# Altium schematic sheet level_shifter.SchDoc
size A4
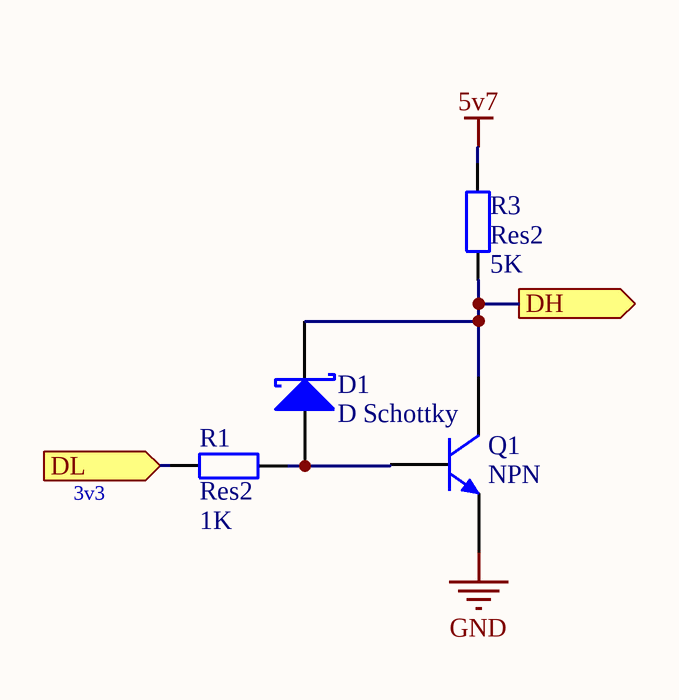
[diagram p0: level_shifter.SchDoc]

## Parts
D1  D Schottky  [SMB]
Q1  NPN  [TO-226-AA]
R1  Res2  value 1K  [AXIAL-0.4]
R3  Res2  value 5K  [AXIAL-0.4]

## Ports
DH (out), DL (in)

## Nets
5v7: R3.2
GND: Q1.3(E)
DH: D1.2(K) Q1.1(C) R3.1 ; port DH
DL: R1.1 ; port DL
NetD1_1: D1.1(A) Q1.2(B) R1.2

## Library data of the parts
D1 = D Schottky: Schottky Diode; Published: 8-Jun-2000; LatestRevisionDate: 17-Jul-2002; LatestRevisionNote: Re-released for DXP Platform.; PackageReference: SMB; Publisher: Altium Limited; PackageDescription: DO-214-AA/SMB; 2 C-Bend Leads; Body 5.3 x 3.6 mm, inc. leads (LxW); Code_JEDEC: DO-214-AA
Q1 = NPN: NPN Bipolar Transistor; Published: 8-Jun-2000; LatestRevisionDate: 17-Jul-2002; LatestRevisionNote: Re-released for DXP Platform.; PackageReference: TO-226-AA; Publisher: Altium Limited; PackageDescription: TO, Flat Index; 3 In-Line, Axial Leads; Body Dia. 4.8mm; Leads 0.55 x 0.51 mm (max); Code_JEDEC: TO-226-AA
R1 R3 = Res2: Resistor; Published: 8-Jun-2000; LatestRevisionDate: 17-Jul-2002; LatestRevisionNote: Re-released for DXP Platform.; PackageReference: AXIAL-0.4; Publisher: Altium Limited; PackageDescription: Axial Device, Thru-Hole; 2 Leads; 0.4 in Pin Spacing